# Altium schematic sheet DCDC-Converters.SchDoc
size A4
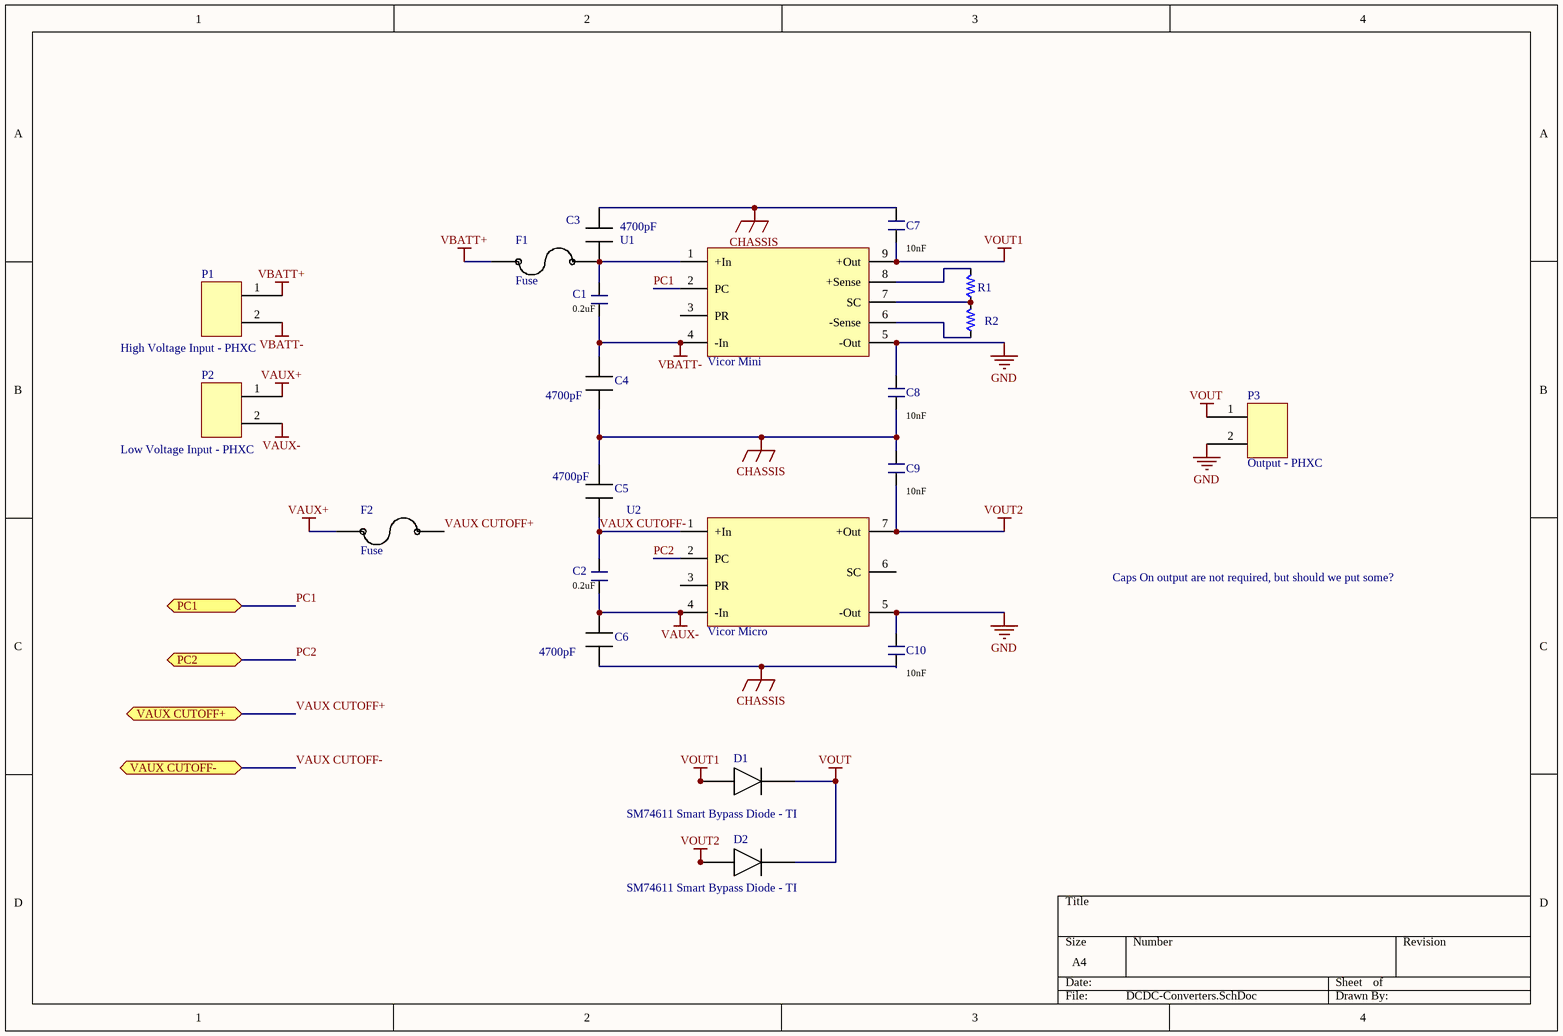
[diagram p0: DCDC-Converters.SchDoc]

## Parts
C1  Capacitance: 0.2uF  [PCB_GENERIC_SMD_0603]  (hidden comment: SCH_GENERIC_CAPACITOR_0603)
C2  Capacitance: 0.2uF  [PCB_GENERIC_SMD_0603]  (hidden comment: SCH_GENERIC_CAPACITOR_0603)
C3  Capacitance: 4700pF  (hidden comment: X1-Y2 Capacitor)
C4  Capacitance: 4700pF  (hidden comment: X1-Y2 Capacitor)
C5  Capacitance: 4700pF  (hidden comment: X1-Y2 Capacitor)
C6  Capacitance: 4700pF  (hidden comment: X1-Y2 Capacitor)
C7  Capacitance: 10nF  [PCB_GENERIC_SMD_0603]  (hidden comment: SCH_GENERIC_CAPACITOR_0603)
C8  Capacitance: 10nF  [PCB_GENERIC_SMD_0603]  (hidden comment: SCH_GENERIC_CAPACITOR_0603)
C9  Capacitance: 10nF  [PCB_GENERIC_SMD_0603]  (hidden comment: SCH_GENERIC_CAPACITOR_0603)
C10  Capacitance: 10nF  [PCB_GENERIC_SMD_0603]  (hidden comment: SCH_GENERIC_CAPACITOR_0603)
D1  SM74611 Smart Bypass Diode - TI
D2  SM74611 Smart Bypass Diode - TI
F1  Fuse
F2  Fuse
P1  High Voltage Input - PHXC
P2  Low Voltage Input - PHXC
P3  Output - PHXC
R1  SCH_GENERIC_RESISTOR_0603  [PCB_GENERIC_SMD_0603]  (value not drawn)
R2  SCH_GENERIC_RESISTOR_0603  [PCB_GENERIC_SMD_0603]  (value not drawn)
U1  Vicor Mini  [Vicor_Mini]
U2  Vicor Micro  [Vicor_Micro]

## Ports
PC1, PC2, VAUX CUTOFF+, VAUX CUTOFF-

## Nets
CHASSIS: C3.2 C4.1 C5.2 C6.1 C7.2 C8.1 C9.2 C10.1
GND: C8.2 C10.2 P3.2 U1.5(-Out) U2.5(-Out)
VAUX+: F2.1 P2.1
VAUX-: C2.1 C6.2 P2.2 U2.4(-In)
VBATT+: F1.1 P1.1
VBATT-: C1.1 C4.2 P1.2 U1.4(-In)
VOUT: D1.4 D2.4 P3.1
VOUT1: C7.1 D1.1 D1.3 U1.9(+Out)
VOUT2: C9.1 D2.1 D2.3 U2.7(+Out)
PC1: U1.2(PC) ; port PC1
PC2: U2.2(PC) ; port PC2
VAUX CUTOFF+: F2.2 ; port VAUX CUTOFF+
VAUX CUTOFF-: C2.2 C5.1 U2.1(+In) ; port VAUX CUTOFF-
NetC1_2: C1.2 C3.1 F1.2 U1.1(+In)
NetR1_1: R1.1 R2.2 U1.7(SC)
NetR1_2: R1.2 U1.8(+Sense)
NetR2_1: R2.1 U1.6(-Sense)

Not connected (* = marked no-connect by the designer): U1 3(PR); U2 3(PR) 6(SC)

## Notes on the sheet
- Caps On output are not required, but should we put some?

## Library data of the parts
C1 C2 C7-C10 = SCH_GENERIC_CAPACITOR_0603: Generic SMD capacitor 0603; Tolerance: *%
C3-C6 = Murata 2220 X1-Y2 Capacitor
P1-P3 = Phoenix Contact 1720466
R1 R2 = SCH_GENERIC_RESISTOR_0603: Generic SMD resistor 0603; Resistance: *